# EAGLE schematic atmega168 (EAGLE 7.4.0)
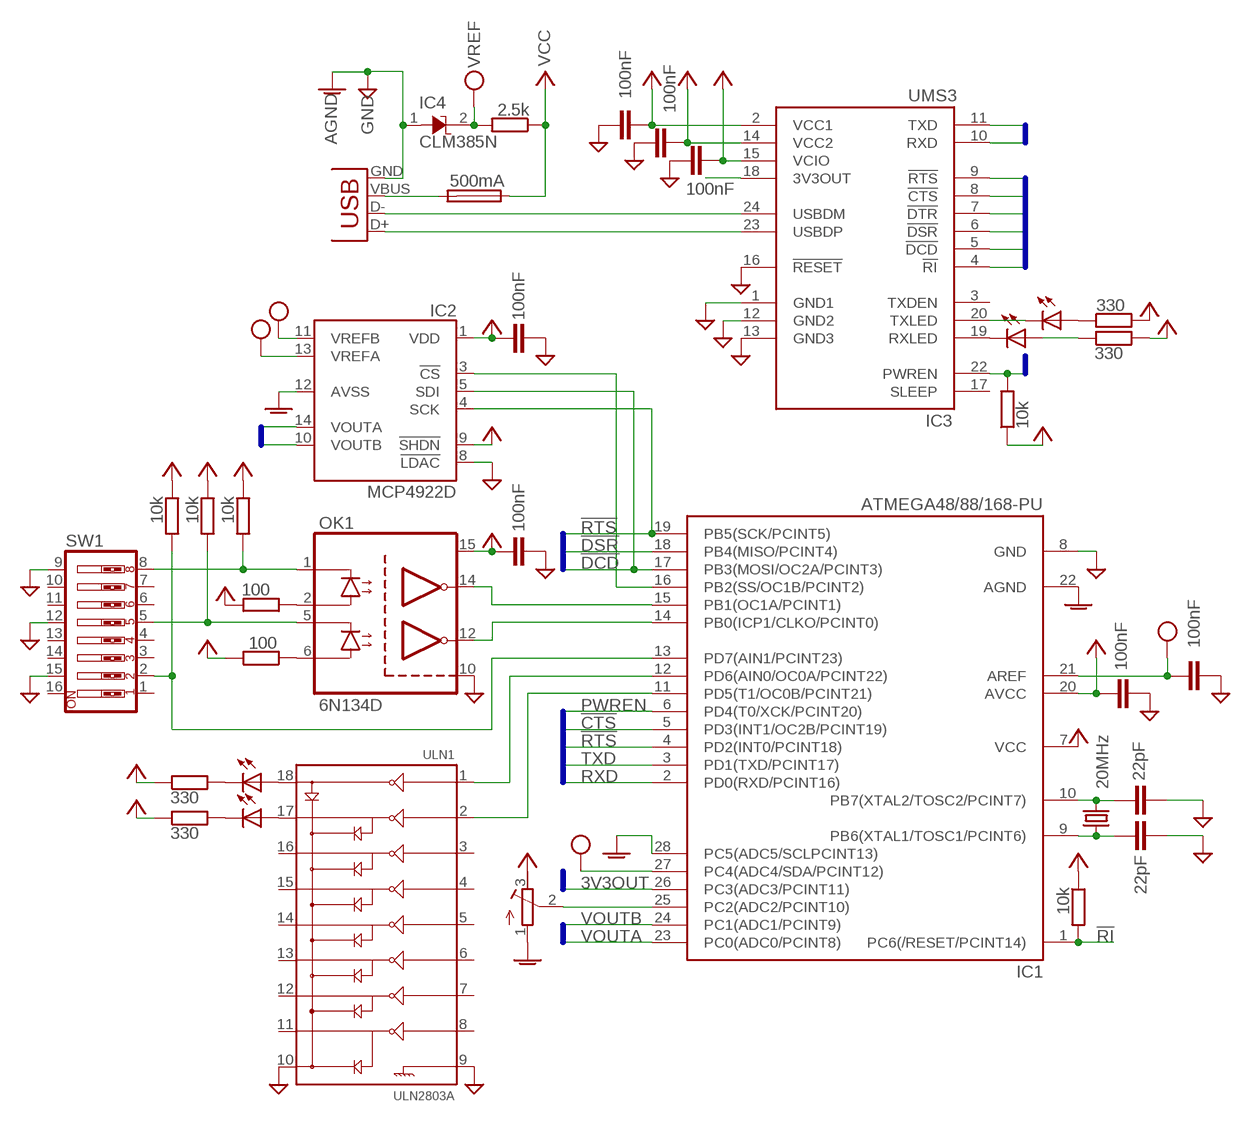
[diagram p0: schematic, sheet 1]

## Parts
C1  100nF  C-EU025-025X050  [C025-025X050]
C2  22pF  C-EU025-025X050  [C025-025X050]
C3  22pF  C-EU025-025X050  [C025-025X050]
C4  100nF  C-EU025-025X050  [C025-025X050]
C5  100nF  C-EU025-025X050  [C025-025X050]
C6  100nF  C-EU025-025X050  [C025-025X050]
C7  100nF  C-EU025-025X050  [C025-025X050]
C8  100nF  C-EU025-025X050  [C025-025X050]
C9  100nF  C-EU025-025X050  [C025-025X050]
F1  500mA  GSH15  [GSH15]
IC1  ATMEGA48/88/168-PU  [DIL28-3]
IC2  MCP4922D  [DIL-14]
IC3  UMS3  USM3  [DIL-24]
IC4  CLM385N  [TO-92]
OK1  6N134D  [DIL-16]
Q1  20MHz  CRYSTALHC49S  [HC49/S]
R1  330  R-EU_0411/12  [0411/12]
R2  330  R-EU_0411/12  [0411/12]
R3  R-TRIMM4G/J  [RTRIM4G/J]
R4  2.5k  R-EU_0411/12  [0411/12]
R5  10k  R-EU_0411/12  [0411/12]
R6  10k  R-EU_0411/12  [0411/12]
R7  100  R-EU_0411/12  [0411/12]
R8  100  R-EU_0411/12  [0411/12]
R9  10k  R-EU_0411/12  [0411/12]
R10  10k  R-EU_0411/12  [0411/12]
R11  10k  R-EU_0411/12  [0411/12]
R12  330  R-EU_0411/12  [0411/12]
R13  330  R-EU_0411/12  [0411/12]
RLED  LED3MM  [LED3MM]
RLED1  LED3MM  [LED3MM]
RLED2  LED3MM  [LED3MM]
SW1  SW_DIP-8  [DIPSWITCH-08]
TLED  LED3MM  [LED3MM]
ULN1  ULN2803A  ULN2803DIP  [DIL18]
X1  USB-PTH  [USB-B-PTH]

## Nets
3V3OUT: IC1.26(PC3(ADC3/PCINT11)) IC3.18(3V3OUT)
!CTS: IC1.5(PD3(INT1/OC2B/PCINT19)) IC3.8(!CTS)
!DCD: IC1.17(PB3(MOSI/OC2A/PCINT3)) IC2.5(SDI) IC3.5(!DCD)
!DSR: IC1.18(PB4(MISO/PCINT4)) IC3.6(!DSR)
!DTR: IC3.7(!DTR)
!RI: IC1.1(PC6(/RESET/PCINT14)) R5.2
!RTS: IC1.4(PD2(INT0/PCINT18)) IC1.19(PB5(SCK/PCINT5)) IC2.4(SCK) IC3.9(!RTS)
AGND: IC1.22(AGND) IC1.28(PC5(ADC5/SCLPCINT13)) IC2.12(AVSS) IC4.1(ANO) R3.1(E) X1.GND ; supply symbol labelled GND
GND: C1.1 C2.1 C3.1 C4.1 C5.2 C6.2 C7.2 C8.2 C9.1 IC1.8(GND) IC2.8(!LDAC) IC3.1(GND1) IC3.12(GND2) IC3.13(GND3) IC3.16(!RESET) OK1.10(GND) SW1.9 SW1.12 SW1.15 ULN1.9 ULN1.10
N$1: IC3.24(USBDM) X1.D-
N$2: IC3.23(USBDP) X1.D+
N$3: IC3.19(RXLED) RLED.K(C)
N$4: F1.2 X1.VBUS
N$5: IC3.20(TXLED) TLED.K(C)
N$6: R1.1 RLED.A
N$7: IC3.4(!RI)
N$8: R2.1 TLED.A
N$9: IC1.12(PD6(AIN0/OC0A/PCINT22)) ULN1.1
N$10: IC1.11(PD5(T1/OC0B/PCINT21)) ULN1.2
N$11: IC1.15(PB1(OC1A/PCINT1)) OK1.14(VOUT1)
N$12: IC1.14(PB0(ICP1/CLKO/PCINT0)) OK1.12(VOUT2)
N$13: IC1.13(PD7(AIN1/PCINT23)) R9.2 SW1.2
N$14: OK1.2(ANODE1) R7.2
N$15: OK1.6(ANODE2) R8.1
N$16: C3.2 IC1.9(PB6(XTAL1/TOSC1/PCINT6)) Q1.1
N$17: C2.2 IC1.10(PB7(XTAL2/TOSC2/PCINT7)) Q1.2
N$18: OK1.5(KATHODE2) R11.2 SW1.5
N$19: IC1.16(PB2(SS/OC1B/PCINT2)) IC2.3(!CS)
N$20: OK1.1(KATHODE1) R10.2 SW1.8
N$21: IC1.25(PC2(ADC2/PCINT10)) R3.2(S)
N$22: RLED2.A ULN1.18
N$23: RLED1.A ULN1.17
N$24: R12.2 RLED1.K(C)
N$25: R13.2 RLED2.K(C)
PWREN: IC1.6(PD4(T0/XCK/PCINT20)) IC3.22(PWREN) R6.2
RXD: IC1.2(PD0(RXD/PCINT16)) IC3.10(RXD)
TXD: IC1.3(PD1(TXD/PCINT17)) IC3.11(TXD)
VCC: C1.2 C4.2 C5.1 C6.1 C7.1 C8.1 C9.2 F1.1 IC1.7(VCC) IC1.20(AVCC) IC1.21(AREF) IC1.27(PC4(ADC4/SDA/PCINT12)) IC2.1(VDD) IC2.9(!SHDN) IC2.11(VREFB) IC2.13(VREFA) IC3.2(VCC1) IC3.14(VCC2) IC3.15(VCIO) IC4.2(CAT) OK1.15(VCC) R1.2 R2.2 R3.3(A) R4.1 R4.2 R5.1 R6.1 R7.1 R8.2 R9.1 R10.1 R11.1 R12.1 R13.1 ; supply symbol labelled AVCC, VREF
VOUTA: IC1.23(PC0(ADC0/PCINT8)) IC2.14(VOUTA)
VOUTB: IC1.24(PC1(ADC1/PCINT9)) IC2.10(VOUTB)
Unconnected: IC3.3(TXDEN) IC3.17(SLEEP) SW1.1 SW1.3 SW1.4 SW1.6 SW1.7 SW1.10 SW1.11 SW1.13 SW1.14 SW1.16 ULN1.3 ULN1.4 ULN1.5 ULN1.6 ULN1.7 ULN1.8 ULN1.11 ULN1.12 ULN1.13 ULN1.14 ULN1.15 ULN1.16

## Buses
B$1
B$2
B$3
B$4
B$5
B$6
B$7
B$8

## Library data of the parts
C1-C9 = resistor:C-EU: CAPACITOR, European symbol
F1 = fuse:GSH15: FUSE HOLDER grid 15mm, 19649 Wickmann
IC1 = atmega8:ATMEGA48/88/168-PU
IC2 = dac:MCP4922: Microchip MCP4922 Dual 12-Bit DAC with SPI interface
IC3 = ftdichip:USM: Asix - UMS USB-UART Wrapper Module UMS3 is an USB->Serial interface module based on the powerful FT232RL chip made by FTDI. It enables very easy connection of the user's application to the PC via the USB port, without necessity of any deep knowledge about the complicated USB problematics. On the USB side of UMS3 there are 2 signals D+ and D-, on the opposite side there are the serial port signals (in the TTL level) with full data flow control. UMS3 is capable to transfer data at speeds up to 3 MBaud. UMS3 contains the on-chip EEPROM for storing the ID data (VID, PID, ID string) and the non-rewritable unique Serial number. UMS3 is manufactured as a DIP24 device with standard pin distance of 2.54 mm (0.1"). It can be put into standard or precision DIP socket or it can be directly soldered to user application PCB. It saves time and money in small medium volume production. The USB connector is to be connected separately, the designer has flexibility in the PCB layout and mechanical design in comparison to modules with built-in USB connector. Also, the A-type, B-type connector or even cable can be used. The UMS3 module supports all powerful features of the FT232R chip like BitBang mode, FTDIChip-ID? Security Dongle, Clock Generator Output, etc.). Another big feature is a 1.8 ... 5 V interface capability. After some minor changes in a target board, the UMS3 module can be used as an older UMS1 module replacement. The procedure is decribed in the User's Guide at http://www.asix.info.
IC4 = ic:CLM385: Voltage Reference Diode 2.5V CLM285-2.5 CLM385-2.5
OK1 = ic:6N134: Hewlett Packard TTL Optocoupler
Q1 = crystal:CRYSTAL: CRYSTAL
R1 R2 R4-R13 = rcl:R-EU_: RESISTOR, European symbol
R3 = resistor:R-TRIMM: Trimm resistor
RLED RLED1 RLED2 TLED = led:LED: LED OSRAM: - CHIPLED LG R971, LG N971, LY N971, LG Q971, LY Q971, LO R971, LY R971 LH N974, LH R974 LS Q976, LO Q976, LY Q976 LO Q996 - Hyper CHIPLED LW Q18S LB Q993, LB Q99A, LB R99A - SideLED LS A670, LO A670, LY A670, LG A670, LP A670 LB A673, LV A673, LT A673, LW A673 LH A674 LY A675 LS A676, LA A676, LO A676, LY A676, LW A676 LS A679, LY A679, LG A679 - Hyper Micro SIDELED® LS Y876, LA Y876, LO Y876, LY Y876 LT Y87S - SmartLED LW L88C, LW L88S LB L89C, LB L89S, LG L890 LS L89K, LO L89K, LY L89K LS L896, LA L896, LO L896, LY L896 - TOPLED LS T670, LO T670, LY T670, LG T670, LP T670 LSG T670, LSP T670, LSY T670, LOP T670, LYG T670 LG T671, LOG T671, LSG T671 LB T673, LV T673, LT T673, LW T673 LH T674 LS T676, LA T676, LO T676, LY T676, LB T676, LH T676, LSB T676, LW T676 LB T67C, LV T67C, LT T67C, LS T67K, LO T67K, LY T67K, LW E67C LS E67B, LA E67B, LO E67B, LY E67B, LB E67C, LV E67C, LT E67C LW T67C LS T679, LY T679, LG T679 LS T770, LO T770, LY T770, LG T770, LP T770 LB T773, LV T773, LT T773, LW T773 LH T774 LS E675, LA E675, LY E675, LS T675 LS T776, LA T776, LO T776, LY T776, LB T776 LHGB T686 LT T68C, LB T68C - Hyper Mini TOPLED® LB M676 - Mini TOPLED Santana® LG M470 LS M47K, LO M47K, LY M47K Source: http://www.osram.convergy.de LUXEON: - LUMILED® LXK2-PW12-R00, LXK2-PW12-S00, LXK2-PW14-U00, LXK2-PW14-V00 LXK2-PM12-R00, LXK2-PM12-S00, LXK2-PM14-U00 LXK2-PE12-Q00, LXK2-PE12-R00, LXK2-PE12-S00, LXK2-PE14-T00, LXK2-PE14-U00 LXK2-PB12-K00, LXK2-PB12-L00, LXK2-PB12-M00, LXK2-PB14-N00, LXK2-PB14-P00, LXK2-PB14-Q00 LXK2-PR12-L00, LXK2-PR12-M00, LXK2-PR14-Q00, LXK2-PR14-R00 LXK2-PD12-Q00, LXK2-PD12-R00, LXK2-PD12-S00 LXK2-PH12-R00, LXK2-PH12-S00 LXK2-PL12-P00, LXK2-PL12-Q00, LXK2-PL12-R00 Source: www.luxeon.com KINGBRIGHT: KA-3528ASYC Source: www.kingbright.com
SW1 = SparkFun:SW_DIP-8: DIP Switch 8 Position Spark Fun Electronics SKU : COM-08034
ULN1 = SparkFun:ULN2803: Darlington Driver ULN2803 Darlington array. 500mA max per channel, 8-channel package. Spark Fun Electronics SKU : COM-00312
X1 = con-usb:USB: USB Connectors USB-B-PTH is fully proven SKU : PRT-00139 USB-miniB is fully proven SKU : PRT-00587 USB-A-PCB is untested. USB-A-H is throughly reviewed, but untested. Spark Fun Electronics SKU : PRT-00437 USB-B-SMT is throughly reviewed, but untested. Needs silkscreen touching up. USB-A-S has not been used/tested USB-MB-H has not been used/tested